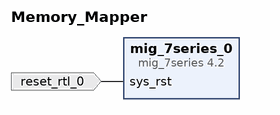
[diagram p0: block diagram of the top level]
# Vivado block design Memory_Mapper, xc7a100tfgg484-1, Vivado 2025.2
create_bd_design Memory_Mapper

create_bd_port -dir I -type rst reset_rtl_0
set_property -dict {CONFIG.POLARITY ACTIVE_LOW} [get_bd_ports reset_rtl_0]

create_bd_cell -type ip -vlnv xilinx.com:ip:mig_7series:4.2 mig_7series_0

# ---- connections ----

connect_bd_net -net reset_rtl_0_1 [get_bd_ports reset_rtl_0] [get_bd_pins mig_7series_0/sys_rst]

validate_bd_design
save_bd_design
